# Altium project PI_CAN_Interface_v2.PrjPcb
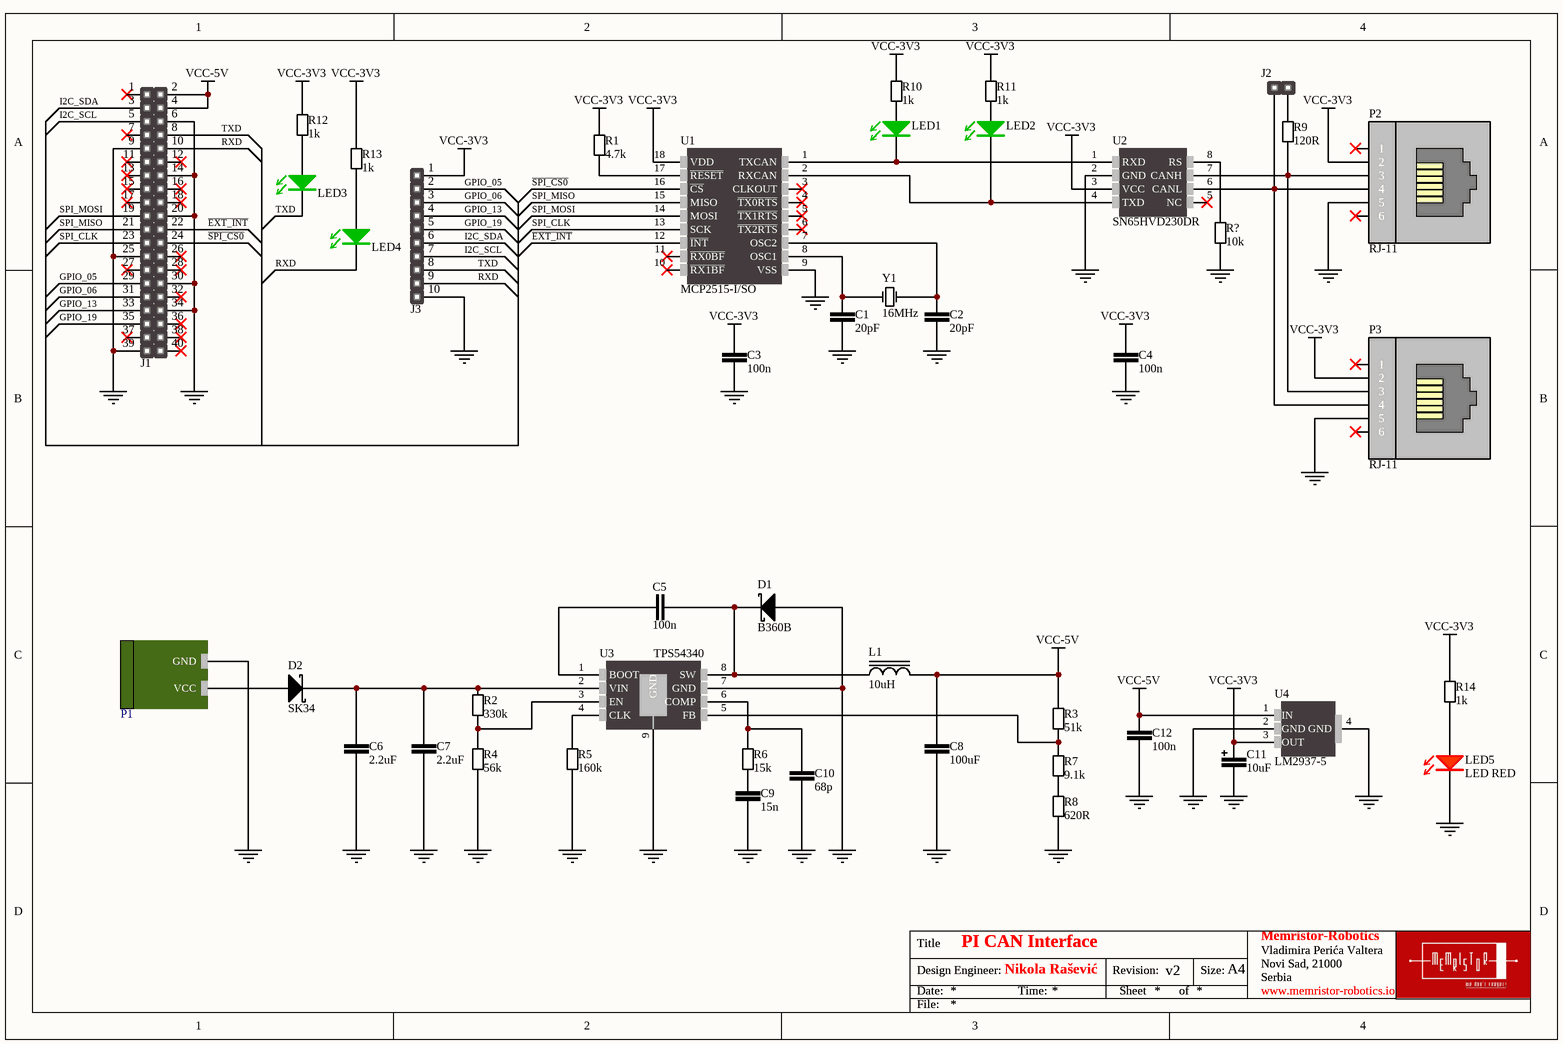
[diagram p0: PI_CAN_Interface_v2.SchDoc]
1 sheet, 46 parts. Net scope: global (net labels, ports and power ports of the same name join across sheets).
Board file: PI_CAN_Interface_v2.PcbDoc

## Sheet PI_CAN_Interface_v2.SchDoc: PI CAN Interface
size A4; Author: Nikola Rašević; Organization: Memristor-Robotics; Address1: Vladimira Perića Valtera; Address2: Novi Sad, 21000; Address3: Serbia; Revision: v2

### Parts
C1  20pF  [CER_0603]
C2  20pF  [CER_0603]
C3  100n  [CER_0603]
C4  100n  [CER_0603]
C5  100n  [CER_0603]
C6  2.2uF  [CER_1210]
C7  2.2uF  [CER_1210]
C8  100uF  [CER_1210]
C9  15n  [CER_0603]
C10  68p  [CER_0603]
C11  10uF  [TANT_1210]
C12  100n  [CER_0603]
D1  B360B  [DO214AC]
D2  SK34  [DO214AC]
J1  00000005  [HM2X20]  (value not drawn)
J2  *  [HM1x2]  (value not drawn)
J3  00000006  [HM1X10]  (value not drawn)
L1  10uH  [INDUCTOR_SS1260-103MLD]
LED1  LED GREEN  [LED_GREEN_0805]  (value not drawn)
LED2  LED GREEN  [LED_GREEN_0805]  (value not drawn)
LED3  LED GREEN  [LED_GREEN_0805]  (value not drawn)
LED4  LED GREEN  [LED_GREEN_0805]  (value not drawn)
LED5  LED RED  [LED_RED_0805]
P1  *  [PWR_Con]  (value not drawn)
P2  RJ-11  [RJ11-6N-B]
P3  RJ-11  [RJ11-6N-B]
R1  4.7k  [RESC2013X38N-0805-NOOVERLAY]
R2  330k  [RESC2013X38N-0805-NOOVERLAY]
R3  51k  [RESC2013X38N-0805-NOOVERLAY]
R4  56k  [RESC2013X38N-0805-NOOVERLAY]
R5  160k  [RESC2013X38N-0805-NOOVERLAY]
R6  15k  [RESC2013X38N-0805-NOOVERLAY]
R7  9.1k  [RESC2013X38N-0805-NOOVERLAY]
R8  620R  [RESC2013X38N-0805-NOOVERLAY]
R9  120R  [RESC2013X38N-0805-NOOVERLAY]
R10  1k  [RESC2013X38N-0805-NOOVERLAY]
R11  1k  [RESC2013X38N-0805-NOOVERLAY]
R12  1k  [RESC2013X38N-0805-NOOVERLAY]
R13  1k  [RESC2013X38N-0805-NOOVERLAY]
R14  1k  [RESC2013X38N-0805-NOOVERLAY]
R?  10k  [RESC2013X38N-0805-NOOVERLAY]
U1  MCP2515-I/SO  [SOIC-18]
U2  SN65HVD230DR  [SOIC-8]
U3  TPS54340  [HSOP-8]
U4  LM2937-5  [SOT223]
Y1  16MHz  [OSCILATOR]

### Nets
GND: C1.1 C2.1 C3.1 C4.1 C6.1 C7.1 C8.1 C9.1 C10.1 C11.2 C12.1 D1.2(Anode) J1.6 J1.9 J1.14 J1.20 J1.25 J1.30 J1.34 J1.39 J3.10 LED5.1(C) P1.1(GND) P2.5 P3.5 R4.1 R5.1 R8.1 R?.1 U1.9(VSS) U2.2(GND) U3.7(GND) U3.9(GND) U4.2(GND) U4.4(GND)
VCC-3V3: C3.2 C4.2 C11.1 J3.1 P2.2 P3.2 R1.2 R10.2 R11.2 R12.2 R13.2 R14.2 U1.18(VDD) U2.3(VCC) U4.3(OUT)
VCC-5V: C8.2 C12.2 J1.2 J1.4 L1.2 R3.2 U4.1(IN)
~{EXT_INT}: J1.22 U1.12(~{INT})
GPIO_05: J1.29 J3.2
GPIO_06: J1.31 J3.3
GPIO_13: J1.33 J3.4
GPIO_19: J1.35 J3.5
I2C_SCL: J1.5 J3.7
I2C_SDA: J1.3 J3.6
RXD: J1.10 J3.9 LED4.1(C)
~{SPI_CS0}: J1.24 U1.16(~{CS})
SPI_CLK: J1.23 U1.13(SCK)
SPI_MISO: J1.21 U1.15(MISO)
SPI_MOSI: J1.19 U1.14(MOSI)
TXD: J1.8 J3.8 LED3.1(C)
NetC1_2: C1.2 U1.8(OSC1) Y1.2(OSC2)
NetC2_2: C2.2 U1.7(OSC2) Y1.1(OSC1)
NetC5_1: C5.1 U3.1(BOOT)
NetC5_2: C5.2 D1.1(Cathode) L1.1 U3.8(SW)
NetC6_2: C6.2 C7.2 D2.1(Cathode) R2.2 U3.2(VIN)
NetC9_2: C9.2 R6.1
NetC10_2: C10.2 R6.2 U3.6(COMP)
NetD2_2: D2.2(Anode) P1.2(VCC)
NetJ2_1: J2.1 P2.4 P3.4 U2.6(CANL)
NetJ2_2: J2.2 R9.2
NetLED1_1: LED1.1(C) U1.1(TXCAN) U2.1(RXD)
NetLED1_2: LED1.2(A) R10.1
NetLED2_1: LED2.1(C) U1.2(RXCAN) U2.4(TXD)
NetLED2_2: LED2.2(A) R11.1
NetLED3_2: LED3.2(A) R12.1
NetLED4_2: LED4.2(A) R13.1
NetLED5_2: LED5.2(A) R14.1
NetP2_3: P2.3 P3.3 R9.1 U2.7(CANH)
NetR1_1: R1.1 U1.17(~{RESET})
NetR2_1: R2.1 R4.2 U3.3(EN)
NetR3_1: R3.1 R7.2 U3.5(FB)
NetR5_2: R5.2 U3.4(CLK)
NetR7_1: R7.1 R8.2
NetR?_2: R?.2 U2.8(RS)

Not connected (* = marked no-connect by the designer): J1 1* 7* 11* 12* 13* 15* 16* 17* 18* 26* 27* 28* 32* 36* 37* 38* 40*; P2 1* 6*; P3 1* 6*; U1 3(CLKOUT)* 4(~{TX0RTS})* 5(~{TX1RTS})* 6(~{TX2RTS})* 10(~{RX1BF})* 11(~{RX0BF})*; U2 5(NC)*

### Notes on the sheet
- Title
- Date:
- Design Engineer:
- Time:
- Revision:
- Sheet
- of
- Size:
- A4
- www.memristor-robotics.io
- File:

### Library data of the parts
C1 C2 = 00002200: CAP CER 20p 0805; Capacitance: 20pF
C3-C5 C12 = 06032105: CAP CER 100n 10V X5R 10% 0603; Capacitance: 100n
C6 C7 = 00002225: CAP CER 2.2u X7R 100V 20% 1210; Capacitance: 2.2uF
C8 = 00002108: CAP CER 100u X5R 6.3V 10% 1210; Capacitance: 100uF
C9 = 06032153: CAP CER 15n 0603; Capacitance: 15n
C10 = 06032680: CAP CER 68p 0603; Capacitance: 68p
C11 = 00001106: CAP TANT 10u; Value: 10uF
D1 = B360B: DIODE SCHOTTKY 60V 3A DO214AC; Manufacturer: Vishay Semiconductor Diodes Division; Barcode: 0100000007488; id: 62; Assembly: SMD; Speed: Fast Recovery =< 500ns, > 200mA (Io); Voltage  Forward: 550mV @ 3A; item_id: 1025; Recommended Rating: Silver; Manufacturer Part Number: B360B; Category: Discrete Semiconductor Products; Datasheet URL: http://www.vishay.com/docs/88896/b330la.pdf; Package Case: DO-214AC, SMA; Family: DIODE; Voltage  DC Reverse: 60V; Current  Average Rectified: 3A; Diode Type: Schottky; Part Type: Discrete Semiconductors
D2 = SK34: DIODE SCHOTTKY 40V 3A DO214AC; Manufacturer: Vishay Semiconductor Diodes Division; Barcode: 0100000007488; id: 62; Assembly: SMD; Speed: Fast Recovery =< 500ns, > 200mA (Io); Voltage  Forward: 550mV @ 3A; item_id: 1025; Recommended Rating: Silver; Manufacturer Part Number: SK34; Category: Discrete Semiconductor Products; Datasheet URL: http://www.vishay.com/docs/88896/b330la.pdf; Package Case: DO-214AC, SMA; Family: DIODE; Voltage  DC Reverse: 40V; Current  Average Rectified: 3A; Diode Type: Schottky; Part Type: Discrete Semiconductors
J2 = 00000003: Manufacturer Part Number: *
L1 = IND_10uH: FIXED IND 10uH 3A; Manufacturer: Coilcraft; Manufacturer Part Number: XAL7030-103MEB; Assembly: SMD; Tolerance: 20%; DC Resistance: 45mOhm; Category: Inductors, Coils, Chokes; Datasheet URL: http://www.mouser.com/ds/2/597/MSS7348-1076571.pdf; Package Case: 8x8mm; Inductance: 10uH; Current Rating: 3A; Family: INDUCTOR; Part Type: Inductor, Transf, Filter, Ferrite; Product Page Mouser: https://eu.mouser.com/ProductDetail/Coilcraft/MSS7348-103MEB/?qs=sGAEpiMZZMsg%252by3WlYCkU%252bbmGPYv72aIHZue6QQJkp0%3d
LED1-LED4 = LED_GREEN 0805: LED GREEN CLEAR 0805 SMD; Manufacturer: Kingbright; Manufacturer Part Number: APT2012SGC; Barcode: 2911010024338; id: 28; Voltage Forward: 2.2V; Wavelength: 568nm; Lens Color: Colorless; item_id: 3342; Recommended Rating: Platinum; Category: Optoelectronics; Assembly: SMD; Datasheet URL: http://www.kingbrightusa.com/images/catalog/SPEC/APT2012SGC.pdf; Package Case: 0805 (2012 Metric); Color: Green; Family: LED; Lens Transparency: Clear; Part Type: Optoelectronics
LED5 = LED_RED_0805: LED RED 0805; Manufacturer: BRIGHT LED ELECTRONICS; Manufacturer Part Number: BL-HUB35A-AV-TRB; Barcode: 2911010024321; id: 35; Assembly: SMD; Voltage Forward: 2.0 V; item_id: 3341; Recommended Rating: Platinum; Package Case: 0805 (2012 Metric); Color: Red; Family: LED; Part Type: Optoelectronics
P1 = 00000002: Manufacturer Part Number: *
P2 P3 = 00000001: Manufacturer Part Number: RJ-11
R1 = 00004701: RES SMD 4.7 kOhm 1/8W 0805; Power: 0.125W, 1/8W; Resistance: 4.7k; Assembly: SMD; Barcode: 00004701
R2 = 00003303: RES SMD 330 kOhm 1/8W 0805; Power: 0.125W, 1/8W; Resistance: 330k; Assembly: SMD; Barcode: 00003303
R3 = 00005102: RES SMD 51 kOhm 1/8W 0805; Power: 0.125W, 1/8W; Resistance: 51k; Assembly: SMD; Barcode: 00005102
R4 = 00005602: RES SMD 56 kOhm 1/8W 0805; Power: 0.125W, 1/8W; Barcode: 00004701; Resistance: 56k; Assembly: SMD
R5 = 00001603: RES SMD 160 kOhm 1/8W 0805; Power: 0.125W, 1/8W; Resistance: 160k; Assembly: SMD; Barcode: 00001603
R6 = 00001502: RES SMD 15 kOhm 1/8W 0805; Power: 0.125W, 1/8W; Resistance: 15k; Assembly: SMD; Barcode: 00001502
R7 = 00009101: RES SMD 9.1 kOhm 1/8W 0805; Power: 0.125W, 1/8W; Resistance: 9.1k; Assembly: SMD; Barcode: 00009101
R8 = 00006200: RES SMD 620 Ohm 1/8W 0805; Power: 0.125W, 1/8W; Resistance: 620R; Assembly: SMD; Barcode: 00006200
R9 = 000001200: RES SMD 120 Ohm 1/8W 0805; Resistance: 120R
R10-R14 = 00001001: RES SMD 1 kOhm 1/8W 0805; Power: 0.125W, 1/8W; Barcode: 00009101; Resistance: 1k; Assembly: SMD
R? = 000001002: RES SMD 10 kOhm 1/8W 0805; Resistance: 10k
U1 = MCP2515: IC CAN CONTROLLER W/SPI 18SOIC; Assembly: SMD; Barcode: 00000002; Manufacturer Part Number: MCP2515-I/SO; Comet Product Page: http://store.comet.rs/Catalogue/Product/6292/; Package: SOIC-18; Category: Integrated Circuits (ICs); Datasheet Link: http://ww1.microchip.com/downloads/en/DeviceDoc/21801d.pdf; Subcategory: Comunication
U2 = SN65HVD230: IC EMC CAN TRANSCEIVER 8-SOIC; Assembly: SMD; Barcode: 00000001; Manufacturer Part Number: SN65HVD230DR; Comet Product Page: http://store.comet.rs/Catalogue/Product/9057/; Datasheet Link: http://www.ti.com/lit/ds/symlink/sn65hvd232.pdf; Category: Integrated Circuits (ICs); Package: SOIC-8; Family: Comunication
U3 = 00000003: DC-DC Buck Regulator; Assembly: SMD; Manufacturer Part Number: TPS54340
U4 = 00000007: IC REG LINEAR 5V 400MA SOT223-4; Manufacturer Part Number: LM2937-5; Datasheet Link: http://www.ti.com/lit/ds/symlink/lm2937.pdf
Y1 = XtalSmd: Crystal Oscillator; Order Code: Q16.000 MHz HC-49SM SMD; Published: 8-Jun-2000; LatestRevisionDate: 17-Jul-2002; LatestRevisionNote: Re-released for DXP Platform.; PackageReference: R38; Publisher: Altium Limited; Supplier: Comet.rs; Value: 16MHz